# EAGLE design feedthrough_board (EAGLE 9.3.0)
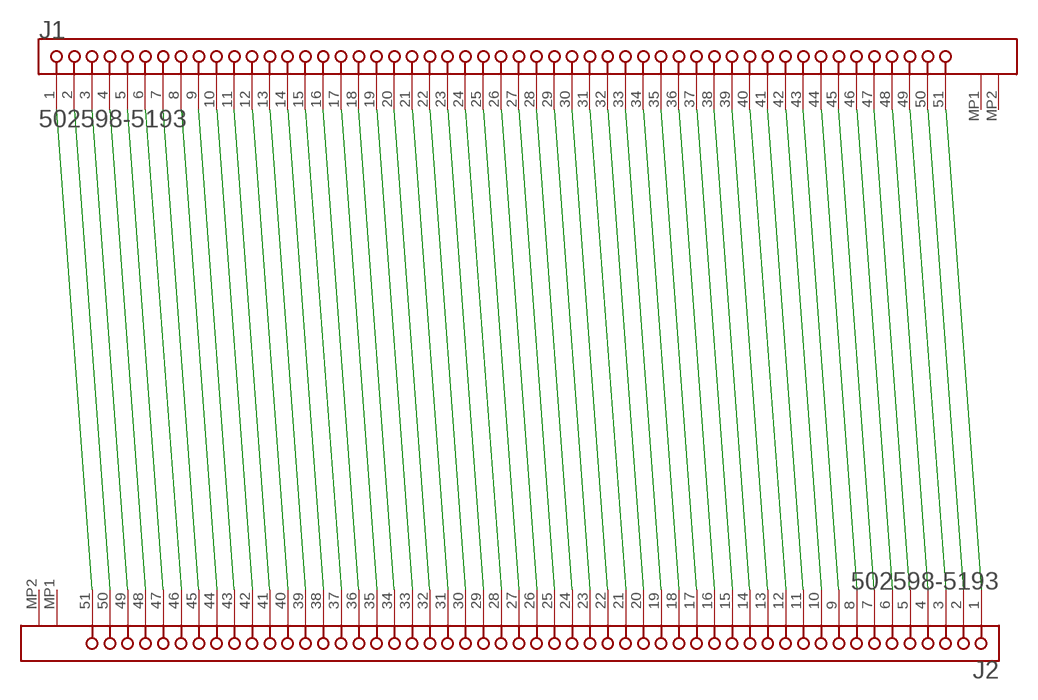
[diagram p0: schematic, sheet 1]

## Parts
J1  MOLEX_502598-5193MOLEX_502598-5193_0_0  [MOLEX_502598-5193_0]
J2  MOLEX_502598-5193MOLEX_502598-5193_0_0  [MOLEX_502598-5193_0]

## Nets
A1: J1.1 J2.51
A2: J1.2 J2.50
A3: J1.3 J2.49
A4: J1.4 J2.48
A5: J1.5 J2.47
A6: J1.6 J2.46
A7: J1.7 J2.45
A8: J1.8 J2.44
A9: J1.9 J2.43
A10: J1.10 J2.42
A11: J1.11 J2.41
A12: J1.12 J2.40
A13: J1.13 J2.39
A14: J1.14 J2.38
A15: J1.15 J2.37
A16: J1.16 J2.36
A17: J1.17 J2.35
A18: J1.18 J2.34
A19: J1.19 J2.33
A20: J1.20 J2.32
A21: J1.21 J2.31
A22: J1.22 J2.30
A23: J1.23 J2.29
A24: J1.24 J2.28
A25: J1.25 J2.27
A26: J1.26 J2.26
A27: J1.27 J2.25
A28: J1.28 J2.24
A29: J1.29 J2.23
A30: J1.30 J2.22
A31: J1.31 J2.21
A32: J1.32 J2.20
A33: J1.33 J2.19
A34: J1.34 J2.18
A35: J1.35 J2.17
A36: J1.36 J2.16
A37: J1.37 J2.15
A38: J1.38 J2.14
A39: J1.39 J2.13
A40: J1.40 J2.12
A41: J1.41 J2.11
A42: J1.42 J2.10
A43: J1.43 J2.9
A44: J1.44 J2.8
A45: J1.45 J2.7
A46: J1.46 J2.6
A47: J1.47 J2.5
A48: J1.48 J2.4
A49: J1.49 J2.3
A50: J1.50 J2.2
A51: J1.51 J2.1
Unconnected: J1.MP1 J1.MP2 J2.MP1 J2.MP2

## Library data of the parts
J1 J2 = Molex - 502598-5193:MOLEX_502598-5193: MOLX-502598-5193; CIIVA_IDS: 8412513; CIRCUITS_LOADED: 51; COMPONENT_LINK_1_DESCRIPTION: Manufacturer URL; COMPONENT_LINK_1_URL: http://www.molex.com/molex/index.jsp; COMPONENT_LINK_3_DESCRIPTION: Package Specification; COMPONENT_LINK_3_URL: http://www.molex.com/pdm_docs/sd/5025985193_sd.pdf; CONTACT_POSITION: Dual; CURRENT_MAX_PER_CONTACT: 0.2A; DATASHEET: http://www.molex.com/webdocs/datasheets/pdf/en-us/5025985193_FFC_FPC_CONNECTORS.pdf; DURABILITY_MATING_CYCLES_MAX: 10; ENTRY_ANGLE: 90degrees Angle; FOOTPRINT_VARIANT_NAME_0: Manufacturer Recommended; IMPORTED: yes; IMPORTED_FROM: vault; IMPORT_TS: 1521860080; MATED_HEIGHT: 1.15mm; MATERIAL___METAL: Copper Alloy, Phosphor Bronze; MATERIAL___PLATING_MATING: Gold; MATERIAL___PLATING_TERMINATION: Gold, Tin; MF: Molex; MOUNTING_TECHNOLOGY: Surface Mount; MPN: 502598-5193; NUMBER_OF_ROWS: 1; ORIENTATION: Right Angle; PACKAGE: 502598-5193; PACKAGE_DESCRIPTION: 51-Lead FPC Connector, Pitch 0.3 mm; PACKAGE_VERSION: Rev. B, 08/2013; PACKING: Tape and Reel; PCB_LOCATOR: No; PCB_RETENTION: Yes; PITCH___MATING_INTERFACE: 0.30mm; POLARIZED_TO_PCB: Yes; PREFIX: J; RELEASE_DATE: 1411372322; ROHS: Yes; STACKABLE: No; VAULT_GUID: 79943B7E-3FDB-4B6C-B1B1-74E826A886CC; VAULT_REVISION: 2B392736-9C86-4257-9195-559BF0CEA94B; VOLTAGE_MAX: 50V AC (RMS)/DC

## Net classes
0 signal: width 0.127 mm, clearance 0.127 mm

## Board
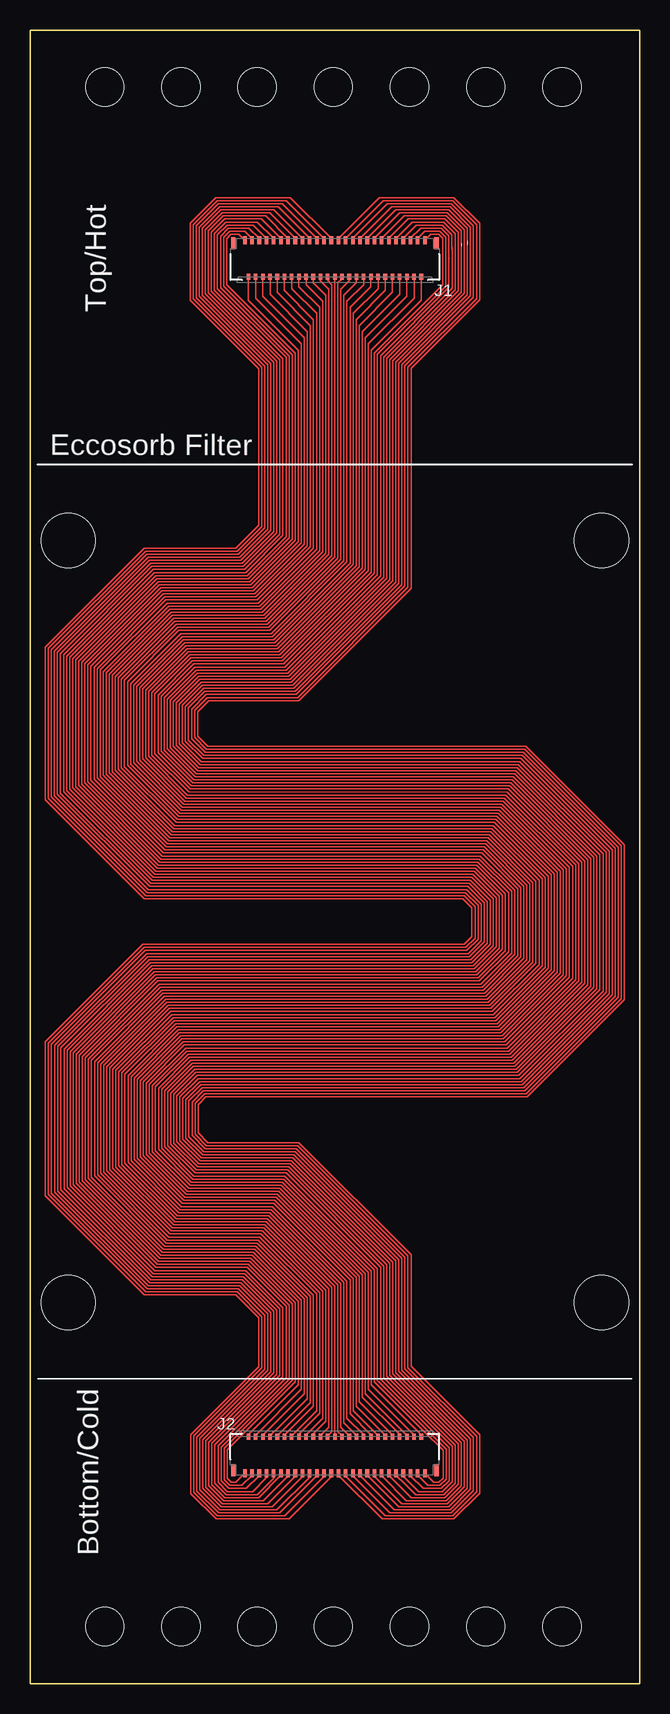
[diagram p1: board, top side]

Size 50.8 x 137.79 mm. Coordinates in mm from the lower left corner, seen from the top.
Outline: 50.8,51.44 50.8,52.07
Outline: 0,51.44 0,52.07
Outline: 0,0 50.8,0 50.8,137.79 0,137.79 0,0
Copper layers (1*16): Top 0.035mm / dielectric 0.25mm / Bottom 0.035mm
Design rules "SparkFun-2-layer-FAB-LIMIT *": minimum track width 5mil, minimum drill 0.2mm, track to track 5mil, track to pad 5mil, pad to pad 5mil, via to via 5mil, smd to smd 5mil, copper to edge 5mil, drill to drill 5mil, minimum pad ring 3mil, minimum via ring 3mil, stop-mask expansion 5mil, vias tented up to drill 25mil, thermal gap 10mil
Holes 3.17 mm at 6.22,4.76 44.32,4.76 12.57,4.76 37.97,4.76 18.92,4.76 25.27,4.76 31.62,4.76 6.22,133.03 44.32,133.03 12.57,133.03 37.97,133.03 18.92,133.03 25.27,133.03 31.62,133.03
Holes 4.5 mm at 3.17,31.75 47.62,31.75 47.62,95.25 3.17,95.25
tRestrict: area 0,92.1 to 6.3,98.4; area 44.5,92.1 to 50.8,98.4; area 44.5,28.6 to 50.8,34.9; area 0,28.6 to 6.3,34.9; area 15.9,115.1 to 34.9,121.2; area 17.3,111.4 to 33.5,116.2; area 16,16.1 to 34.8,22.2
bRestrict: area 0,92.1 to 6.3,98.4; area 44.5,92.1 to 50.8,98.4; area 44.5,28.6 to 50.8,34.9; area 0,28.6 to 6.3,34.9; area 3.2,130.2 to 47.6,136.5; area 3.2,1.6 to 47.6,7.9
vRestrict: area 15.9,16.5 to 34.9,21.6

### Footprints (pad centres in the part's own frame; a part is rotated, then mirrored left to right if it is on the bottom)
MOLEX_502598-5193_0 = smd 0.3 x 0.67: 1 -7.5,-1.532; 3 -6.9,-1.532; 5 -6.3,-1.532; 7 -5.7,-1.532; 9 -5.1,-1.532; 11 -4.5,-1.532; 13 -3.9,-1.532; 15 -3.3,-1.532; 17 -2.7,-1.532; 19 -2.1,-1.532; 21 -1.5,-1.532; 23 -0.9,-1.532; 25 -0.3,-1.532; 27 0.3,-1.532; 29 0.9,-1.532; 31 1.5,-1.532; 33 2.1,-1.532; 35 2.7,-1.532; 37 3.3,-1.532; 39 3.9,-1.532; 41 4.5,-1.532; 43 5.1,-1.532; 45 5.7,-1.532; 47 6.3,-1.532; 49 6.9,-1.532; 51 7.5,-1.532 | smd 0.3 x 0.5: 2 -7.2,1.532; 4 -6.6,1.532; 6 -6,1.532; 8 -5.4,1.532; 10 -4.8,1.532; 12 -4.2,1.532; 14 -3.6,1.532; 16 -3,1.532; 18 -2.4,1.532; 20 -1.8,1.532; 22 -1.2,1.532; 24 -0.6,1.532; 26 0,1.532; 28 0.6,1.532; 30 1.2,1.532; 32 1.8,1.532; 34 2.4,1.532; 36 3,1.532; 38 3.6,1.532; 40 4.2,1.532; 42 4.8,1.532; 44 5.4,1.532; 46 6,1.532; 48 6.6,1.532; 50 7.2,1.532 | smd 0.35 x 1: MP1 -8.475,-1.267; MP2 8.475,-1.267

### Placement (x,y rotation side)
J1  25.4,118.75 180 top
J2  25.4,19.05 0 top

### Tracks (layer width: path | path; a pad name or v marks a point on that pad's centre or on a via)
A1
  Top 0.127: J2.51 33.65,16.76 34.05,16.76 34.42,17.13 34.42,19.43 32.83,21.02 28.7,25.15 28.7,34.48 21.14,42.04 13.54,42.04 10.96,44.62 10.96,49.51 13.4,51.94 40.19,51.94 46.48,58.23 46.48,68.64 40.07,75.06 13.54,75.06 10.92,77.68 10.92,82.26 13.62,84.96 21.14,84.96 28.7,92.52 28.7,110.86 34.4,116.56 34.4,119.25 34.4,119.41 34.4,120.43 34.05,120.78 33.4,120.78 J1.1
A2
  Top 0.127: J2.50 32.6,20.74 28.45,24.89 28.45,34.37 21.04,41.78 13.44,41.78 10.71,44.51 10.71,49.62 13.29,52.2 40.09,52.2 46.23,58.34 46.23,68.54 39.96,74.8 13.44,74.8 10.67,77.58 10.67,82.36 13.52,85.22 21.04,85.22 28.45,92.63 28.45,111.12 32.6,115.28 J1.2
A3
  Top 0.127: J2.49 32.3,17.36 33.15,16.51 34.16,16.51 34.67,17.02 34.67,19.54 30.61,23.6 30.61,23.62 29.08,25.15 29.06,25.15 28.96,25.25 28.96,34.58 21.25,42.29 13.65,42.29 11.22,44.72 11.22,49.41 13.5,51.69 40.3,51.69 46.74,58.13 46.74,68.75 40.17,75.31 13.65,75.31 11.18,77.78 11.18,82.16 13.73,84.71 21.25,84.71 28.96,92.42 28.96,110.75 34.66,116.46 34.66,119.38 34.66,119.51 34.66,120.53 34.16,121.03 32.9,121.03 32.3,120.44 J1.3
A4
  Top 0.127: J2.48 32,20.7 28.19,24.51 28.19,34.27 20.93,41.53 13.33,41.53 10.46,44.41 10.46,49.72 13.19,52.45 39.98,52.45 45.97,58.44 45.97,68.43 39.86,74.55 13.33,74.55 10.41,77.47 10.41,82.47 13.41,85.47 20.93,85.47 28.19,92.73 28.19,111.63 32,115.44 J1.4
A5
  Top 0.127: J2.47 31.7,17.32 32.77,16.26 34.27,16.26 34.92,16.92 34.92,19.66 29.21,25.38 29.21,34.69 21.35,42.55 13.75,42.55 11.47,44.83 11.47,49.3 13.61,51.44 40.4,51.44 46.99,58.02 46.99,68.85 40.28,75.56 13.75,75.56 11.43,77.89 11.43,82.04 13.84,84.45 21.35,84.45 29.21,92.31 29.21,110.65 34.91,116.35 34.91,118.73 34.92,118.75 34.91,118.76 34.91,119.38 34.91,119.61 34.91,120.64 34.27,121.28 32.55,121.28 31.71,120.44 J1.5
A6  (1 unrouted)
  Top 0.127: J2.46 31.4,20.67 27.94,24.13 27.94,34.16 20.83,41.27 13.23,41.27 10.2,44.3 10.2,49.83 13.08,52.7 39.88,52.7 45.72,58.55 45.72,68.33 39.75,74.3 13.23,74.3 10.16,77.36 10.16,82.58 13.31,85.72 20.83,85.72 27.94,92.84 27.94,112.14 31.4,115.6 J1.6
A7
  Top 0.127: 35.18,119.71 35.18,119.51 | 35.18,119.51 35.18,116.26 29.46,110.55 29.46,92.21 21.46,84.2 13.95,84.2 11.68,81.94 11.68,78 13.86,75.82 40.38,75.82 47.24,68.96 47.24,57.92 40.51,51.18 13.71,51.18 11.73,49.2 11.73,44.93 13.86,42.8 21.46,42.8 29.46,34.79 29.46,25.48 35.18,19.77 35.18,16.81 34.37,16 32.38,16 31.1,17.29 J2.45 | 35.18,119.51 35.16,119.52 35.16,120.74 34.37,121.54 32.21,121.54 31.1,120.44 J1.7
A8
  Top 0.127: J2.44 30.8,20.76 27.69,23.88 27.69,34.06 20.72,41.02 13.12,41.02 9.95,44.2 9.95,49.93 12.97,52.96 39.77,52.96 45.47,58.65 45.47,68.22 39.64,74.04 13.12,74.04 9.91,77.26 9.91,82.68 13.2,85.98 20.72,85.98 27.69,92.94 27.69,112.65 30.8,115.76 J1.8
A9
  Top 0.127: J2.43 30.5,17.36 30.87,16.99 30.89,16.99 32.13,15.75 34.47,15.75 35.43,16.71 35.43,19.87 29.72,25.59 29.72,34.9 21.56,43.05 13.97,43.05 11.98,45.04 11.98,49.09 13.82,50.93 40.61,50.93 47.5,57.81 47.5,69.06 40.49,76.07 13.97,76.07 11.94,78.1 11.94,81.83 14.05,83.95 21.56,83.95 29.72,92.1 29.72,110.44 35.43,116.16 35.43,119.81 35.43,120.83 34.47,121.79 31.86,121.79 30.51,120.44 J1.9
A10
  Top 0.127: J2.42 30.2,20.73 27.43,23.5 27.43,33.95 20.62,40.77 13.02,40.77 9.69,44.09 9.69,50.04 12.87,53.21 39.67,53.21 45.21,58.76 45.21,68.11 39.54,73.79 13.02,73.79 9.65,77.15 9.65,82.79 13.1,86.23 20.62,86.23 27.43,93.05 27.43,113.16 30.2,115.92 J1.10
A11
  Top 0.127: J2.41 29.9,17.34 31.75,15.49 34.58,15.49 35.26,16.17 | 35.26,16.17 | 35.26,16.17 35.69,16.6 35.69,19.98 29.97,25.69 29.97,35 21.67,43.31 14.07,43.31 12.23,45.14 12.23,48.98 13.92,50.67 40.72,50.67 47.75,57.71 47.75,69.17 40.59,76.33 14.07,76.33 12.19,78.21 12.19,81.73 14.16,83.69 21.67,83.69 29.97,92 29.97,110.33 35.69,116.05 35.69,119.76 35.69,119.92 35.69,120.94 34.58,122.05 31.52,122.05 29.9,120.44 J1.11
A12
  Top 0.127: J2.40 29.6,20.69 27.18,23.11 27.18,33.85 20.51,40.51 12.91,40.51 9.44,43.99 9.44,50.14 12.76,53.47 39.56,53.47 44.96,58.86 44.96,68.01 39.44,73.53 12.91,73.53 9.4,77.05 9.4,82.89 12.99,86.49 20.51,86.49 27.18,93.15 27.18,113.67 29.6,116.09 J1.12
A13  (2 unrouted)
  Top 0.127: 35.94,120.02 35.94,115.94 30.23,110.23 30.23,91.89 21.77,83.44 14.26,83.44 12.45,81.62 12.45,78.31 14.18,76.58 40.7,76.58 48.01,69.27 48.01,57.6 40.82,50.42 14.03,50.42 12.49,48.88 12.49,45.25 14.18,43.56 21.77,43.56 30.23,35.11 30.23,25.8 35.94,20.08 35.94,16.5 34.69,15.24 31.37,15.24 29.3,17.31 J2.39 | 35.94,119.76 35.94,121.05 34.69,122.3 31.17,122.3 29.3,120.44 J1.13
A14
  Top 0.127: J2.38 29,20.66 26.92,22.73 26.92,33.74 20.41,40.26 12.81,40.26 9.19,43.88 9.19,50.25 12.66,53.72 39.46,53.72 44.7,58.97 44.7,67.91 39.33,73.28 12.81,73.28 9.14,76.94 9.14,83 12.89,86.74 20.41,86.74 26.92,93.26 26.92,114.17 29,116.25 J1.14
A15
  Top 0.127: J2.37 28.7,17.27 30.99,14.99 34.79,14.99 36.2,16.39 36.2,20.19 30.48,25.9 30.48,35.22 21.88,43.81 14.28,43.81 12.74,45.35 12.74,48.77 14.13,50.16 40.93,50.16 48.26,57.49 48.26,69.38 40.8,76.83 14.28,76.83 12.7,78.42 12.7,81.52 14.37,83.19 21.88,83.19 30.48,91.78 30.48,110.12 36.2,115.84 36.2,119.89 36.2,120.13 36.2,121.15 34.79,122.56 30.82,122.56 28.7,120.44 J1.15
A16
  Top 0.127: J2.36 28.4,20.75 26.67,22.48 26.67,33.64 20.3,40.01 12.7,40.01 8.93,43.78 8.93,50.35 12.55,53.98 39.35,53.98 44.45,59.07 44.45,67.8 39.22,73.03 12.7,73.03 8.89,76.84 8.89,83.1 12.78,87 20.3,87 26.67,93.36 26.67,114.68 28.4,116.41 J1.16
A17  (2 unrouted)
  Top 0.127: 36.45,120.23 36.45,115.73 30.73,110.02 30.73,91.68 21.98,82.93 14.47,82.93 12.95,81.41 12.95,78.52 14.39,77.09 40.91,77.09 48.51,69.48 48.51,57.39 41.03,49.91 14.24,49.91 13,48.67 13,45.46 14.39,44.07 21.98,44.07 30.73,35.32 30.73,26.01 36.45,20.29 36.45,16.29 34.9,14.73 30.73,14.73 28.47,16.99 28.1,17.36 J2.35 | 36.45,119.89 36.45,121.26 34.9,122.81 30.48,122.81 28.1,120.44 J1.17
A18
  Top 0.127: J2.34 27.8,20.71 26.42,22.1 26.42,33.53 20.2,39.75 12.6,39.75 8.68,43.67 8.68,50.46 12.45,54.23 39.25,54.23 44.2,59.18 44.2,67.69 39.12,72.77 12.6,72.77 8.64,76.73 8.64,83.21 12.68,87.25 20.2,87.25 26.42,93.47 26.42,115.19 27.8,116.57 J1.18
A19
  Top 0.127: J2.33 27.5,17.33 30.35,14.48 35,14.48 36.7,16.18 36.7,20.4 30.99,26.11 30.99,35.42 22.09,44.32 14.49,44.32 13.25,45.56 13.25,48.56 14.34,49.66 41.14,49.66 48.77,57.28 48.77,69.59 41.01,77.34 14.49,77.34 13.21,78.63 13.21,81.31 14.58,82.68 22.09,82.68 30.99,91.58 30.99,109.91 36.7,115.63 36.7,119.76 36.7,120.34 36.7,121.36 35,123.06 30.13,123.06 27.5,120.43 J1.19
A20
  Top 0.127: J2.32 27.2,20.68 26.16,21.72 26.16,33.43 20.09,39.5 12.49,39.5 8.42,43.57 8.42,50.56 12.34,54.48 39.14,54.48 43.94,59.28 43.94,67.59 39.01,72.52 12.49,72.52 8.38,76.63 8.38,83.31 12.57,87.5 20.09,87.5 26.16,93.57 26.16,115.7 27.2,116.73 J1.20
A21
  Top 0.127: J2.31 26.9,17.3 29.97,14.22 35.11,14.22 36.96,16.07 36.96,20.5 31.24,26.22 31.24,35.53 22.2,44.58 14.6,44.58 13.5,45.67 13.5,48.46 14.45,49.4 41.24,49.4 49.02,57.18 49.02,69.69 41.12,77.6 14.6,77.6 13.46,78.73 13.46,81.2 14.68,82.42 22.2,82.42 31.24,91.47 31.24,109.81 36.96,115.52 36.96,120.27 36.96,120.44 36.96,121.47 35.11,123.32 29.79,123.32 26.91,120.44 J1.21
A22
  Top 0.127: J2.30 26.6,20.65 25.91,21.34 25.91,33.32 19.99,39.24 12.39,39.24 8.17,43.46 8.17,50.67 12.24,54.74 39.04,54.74 43.69,59.39 43.69,67.48 38.91,72.26 12.39,72.26 8.13,76.52 8.13,83.49 12.4,87.76 19.99,87.76 25.91,93.68 25.91,116.2 26.6,116.9 J1.22
A23
  Top 0.127: J2.29 26.3,17.26 29.59,13.97 35.21,13.97 37.21,15.97 37.21,20.61 31.5,26.32 31.5,35.63 22.3,44.83 14.7,44.83 13.76,45.77 13.76,48.35 14.55,49.15 41.35,49.15 49.28,57.08 49.28,69.8 41.22,77.85 14.7,77.85 13.72,78.84 13.72,81.09 14.79,82.17 22.3,82.17 31.5,91.36 31.5,109.7 37.21,115.42 37.21,119.51 37.21,120.55 37.21,121.57 35.21,123.57 29.44,123.57 26.3,120.44 J1.23
A24
  Top 0.127: J2.28 26,20.65 25.65,21 25.65,33.22 19.88,38.99 12.28,38.99 7.92,43.36 7.92,50.77 12.13,54.99 38.93,54.99 43.43,59.49 43.43,67.38 38.8,72.01 12.28,72.01 7.87,76.42 7.87,83.59 12.29,88.01 19.88,88.01 25.65,93.78 25.65,116.71 26,117.06 J1.24
A25  (1 unrouted)
  Top 0.127: J2.27 25.7,17.35 29.34,13.72 35.32,13.72 37.46,15.86 37.46,20.71 31.75,26.43 31.75,35.74 22.41,45.09 14.81,45.09 14.01,45.88 14.01,48.25 14.66,48.9 41.46,48.9 49.53,56.97 49.53,69.9 41.33,78.11 14.81,78.11 13.97,78.94 13.97,80.99 14.89,81.92 22.41,81.92 31.75,91.26 31.75,109.6 37.46,115.31 37.46,120.27 37.46,120.65 37.46,121.68 35.32,123.83 29.09,123.83 25.69,120.42 25.7,120.4 J1.25
A26
  Top 0.127: J2.26 25.4,33.11 19.77,38.73 12.18,38.73 7.66,43.25 7.66,50.88 12.03,55.24 38.83,55.24 43.18,59.6 43.18,67.27 38.7,71.75 12.18,71.75 7.62,76.31 7.62,83.7 12.19,88.27 19.77,88.27 25.4,93.89 J1.26
A27
  Top 0.127: J2.25 25.1,17.23 21.59,13.72 15.5,13.72 13.38,15.83 13.38,20.75 19.05,26.41 19.05,30.48 17.14,32.38 9.52,32.38 1.27,40.64 1.27,53.47 9.4,61.59 36.2,61.59 36.83,62.23 36.83,64.64 36.07,65.41 9.52,65.41 1.27,73.66 1.27,86.36 9.52,94.61 17.14,94.61 19.05,96.52 19.05,109.56 13.33,115.28 13.33,121.68 15.48,123.83 21.71,123.83 25.09,120.44 J1.27
A28
  Top 0.127: J2.24 24.8,20.65 25.15,21 25.15,33.01 19.67,38.48 12.07,38.48 7.41,43.15 7.41,50.98 11.92,55.5 38.72,55.5 42.93,59.7 42.93,67.17 38.59,71.5 12.07,71.5 7.37,76.21 7.37,83.8 12.08,88.52 19.67,88.52 25.15,94 25.15,116.59 25.08,116.65 24.8,116.93 J1.28
A29
  Top 0.127: J2.23 24.5,17.26 21.21,13.97 15.61,13.97 13.64,15.94 13.64,20.64 19.3,26.31 19.3,30.59 17.25,32.64 9.65,32.64 1.52,40.77 1.52,53.36 9.5,61.34 36.3,61.34 37.08,62.12 37.08,64.75 36.17,65.66 9.65,65.66 1.52,73.79 1.52,86.25 9.63,94.36 17.25,94.36 19.3,96.42 19.3,109.67 13.59,115.39 13.59,121.57 15.59,123.57 21.36,123.57 24.49,120.44 J1.29
A30
  Top 0.127: J2.22 24.2,20.65 24.89,21.34 24.89,32.9 19.56,38.23 11.97,38.23 7.15,43.04 7.15,51.09 11.82,55.75 38.61,55.75 42.67,59.81 42.67,67.06 38.49,71.25 11.97,71.25 7.11,76.1 7.11,83.91 11.98,88.77 19.56,88.77 24.89,94.1 24.89,116.2 24.2,116.9 J1.30
A31
  Top 0.127: J2.21 23.9,17.3 20.83,14.22 15.71,14.22 13.89,16.04 13.89,20.54 19.56,26.2 19.56,30.69 17.35,32.89 9.76,32.89 1.78,40.87 1.78,53.26 9.61,61.09 36.41,61.09 37.34,62.02 37.34,64.85 36.28,65.91 9.76,65.91 1.78,73.89 1.78,86.15 9.73,94.11 17.35,94.11 19.56,96.31 19.56,109.78 13.84,115.49 13.84,121.47 15.69,123.32 21.01,123.32 23.89,120.44 J1.31
A32
  Top 0.127: J2.20 23.6,20.81 24.64,21.84 24.64,32.8 19.46,37.97 11.86,37.97 6.9,42.94 6.9,51.19 11.71,56.01 38.51,56.01 42.42,59.91 42.42,66.96 38.38,70.99 11.86,70.99 6.86,76 6.86,84.01 11.87,89.03 19.46,89.03 24.64,94.2 24.64,115.7 23.6,116.73 J1.32
A33
  Top 0.127: J2.19 23.3,17.2 20.57,14.48 15.82,14.48 14.15,16.15 14.15,20.43 19.81,26.1 19.81,30.8 17.46,33.15 9.86,33.15 2.07,40.94 2.07,53.19 9.71,60.83 36.51,60.83 37.59,61.91 37.59,64.96 36.38,66.17 9.86,66.17 2.03,74 2.03,86.04 9.84,93.85 17.46,93.85 19.81,96.2 19.81,109.88 14.1,115.6 14.1,121.36 15.8,123.06 20.67,123.06 23.29,120.44 J1.33
A34
  Top 0.127: J2.18 23,20.71 24.38,22.1 24.38,32.69 19.35,37.72 11.76,37.72 6.65,42.83 6.65,51.3 11.61,56.26 38.4,56.26 42.16,60.02 42.16,66.85 38.28,70.74 11.76,70.74 6.6,75.89 6.6,84.12 11.77,89.28 19.35,89.28 24.38,94.31 24.38,115.19 23,116.57 J1.34
A35
  Top 0.127: J2.17 22.7,17.24 20.19,14.73 15.92,14.73 14.4,16.25 14.4,20.33 20.07,25.99 20.07,30.9 17.57,33.4 9.97,33.4 2.33,41.04 2.33,53.09 9.82,60.58 36.62,60.58 37.85,61.81 37.85,65.06 36.49,66.42 9.97,66.42 2.29,74.1 2.29,85.94 9.95,93.6 17.57,93.6 20.07,96.1 20.07,109.99 14.35,115.7 14.35,118.75 14.35,120.23 14.35,121.26 15.9,122.81 20.32,122.81 22.7,120.44 J1.35
A36
  Top 0.127: J2.16 22.4,20.78 24.13,22.51 24.13,32.58 19.25,37.47 11.65,37.47 6.39,42.72 6.39,51.4 11.5,56.52 38.3,56.52 41.91,60.13 41.91,66.75 38.17,70.48 11.65,70.48 6.35,75.79 6.35,84.22 11.66,89.53 19.25,89.53 24.13,94.42 24.13,114.68 22.4,116.41 J1.36
A37
  Top 0.127: J2.15 22.1,17.27 19.81,14.99 16.03,14.99 14.65,16.36 14.65,20.22 20.32,25.89 20.32,31.01 17.67,33.66 10.07,33.66 2.58,41.15 2.58,52.98 9.92,60.33 36.72,60.33 38.1,61.7 38.1,65.17 36.59,66.67 10.07,66.67 2.54,74.21 2.54,85.83 10.05,93.34 17.67,93.34 20.32,95.99 20.32,110.09 14.6,115.81 14.6,121.15 16.01,122.56 19.98,122.56 22.09,120.44 J1.37
A38
  Top 0.127: J2.14 21.8,20.66 23.88,22.73 23.88,32.48 19.14,37.21 11.55,37.21 6.14,42.62 6.14,51.51 11.4,56.77 38.19,56.77 41.66,60.23 41.66,66.64 38.07,70.23 11.55,70.23 6.1,75.68 6.1,84.33 11.56,89.79 19.14,89.79 23.88,94.52 23.88,114.17 21.8,116.25 J1.38
A39
  Top 0.127: J2.13 21.5,17.31 19.43,15.24 16.13,15.24 14.91,16.46 14.91,20.11 20.57,25.78 20.57,31.11 17.78,33.91 10.18,33.91 2.84,41.25 2.84,52.88 10.03,60.07 36.83,60.07 38.35,61.6 38.35,65.27 36.7,66.93 10.18,66.93 2.79,74.31 2.79,85.73 10.16,93.09 17.78,93.09 20.57,95.89 20.57,110.2 14.86,115.91 14.86,118.75 14.86,120.02 14.86,121.05 16.11,122.3 19.63,122.3 21.49,120.44 J1.39
A40
  Top 0.127: J2.12 21.2,20.69 23.62,23.11 23.62,32.37 19.04,36.96 11.44,36.96 5.88,42.51 5.88,51.62 11.29,57.02 38.09,57.02 41.4,60.34 41.4,66.54 37.96,69.98 11.44,69.98 5.84,75.58 5.84,84.47 11.42,90.04 19.04,90.04 23.62,94.63 23.62,113.67 21.2,116.09 J1.40
A41
  Top 0.127: J2.11 20.9,17.34 19.05,15.49 16.24,15.49 15.16,16.57 15.16,20.01 20.83,25.68 20.83,31.22 17.88,34.16 10.28,34.16 3.09,41.36 3.09,52.77 10.13,59.82 36.93,59.82 38.61,61.49 38.61,65.38 36.8,67.18 10.28,67.18 3.05,74.42 3.05,85.62 10.26,92.84 17.88,92.84 20.83,95.78 20.83,110.3 15.11,116.02 15.11,118.75 15.11,119.92 15.11,120.94 16.22,122.05 19.28,122.05 20.89,120.44 J1.41
A42
  Top 0.127: J2.10 20.6,20.65 23.37,23.42 23.37,32.27 18.93,36.7 11.33,36.7 5.63,42.41 5.63,51.72 11.19,57.28 37.98,57.28 41.15,60.44 41.15,66.43 37.86,69.72 11.33,69.72 5.59,75.47 5.59,84.57 11.31,90.3 18.93,90.3 23.37,94.73 23.37,113.16 20.6,115.92 J1.42
A43  (1 unrouted)
  Top 0.127: J2.9 20.3,17.12 18.92,15.75 16.34,15.75 15.42,16.68 15.42,19.91 21.08,25.57 21.08,31.32 17.99,34.42 10.39,34.42 3.34,41.46 3.34,52.67 10.24,59.56 37.04,59.56 38.86,61.39 38.86,65.48 36.91,67.44 10.39,67.44 3.3,74.52 3.3,85.52 10.37,92.58 17.99,92.58 21.08,95.68 21.08,110.41 15.37,116.12 15.37,118.75 15.37,119.81 15.37,120.83 16.32,121.79 18.94,121.79 20.29,120.44 J1.43
A44
  Top 0.127: J2.8 20,20.65 20.37,21.02 20.39,21.02 23.11,23.75 23.11,32.16 18.83,36.45 11.23,36.45 5.38,42.3 5.38,51.83 11.08,57.53 37.88,57.53 40.89,60.55 40.89,66.33 37.75,69.47 11.23,69.47 5.33,75.36 5.33,84.68 11.21,90.55 18.83,90.55 23.11,94.84 23.11,112.65 20,115.76 J1.44
A45
  Top 0.127: J2.7 19.7,17.16 18.54,16 16.45,16 15.67,16.78 15.67,19.8 21.34,25.46 21.34,31.43 18.09,34.67 10.49,34.67 3.6,41.57 3.6,52.56 10.34,59.31 37.14,59.31 39.12,61.28 39.12,65.59 37.02,67.69 10.49,67.69 3.56,74.63 3.56,85.41 10.47,92.33 18.09,92.33 21.34,95.57 21.34,110.51 15.62,116.23 15.62,120.73 16.43,121.54 18.59,121.54 19.7,120.44 J1.45
A46  (1 unrouted)
  Top 0.127: J2.6 19.4,20.67 22.86,24.13 22.86,32.06 18.72,36.2 11.12,36.2 5.12,42.2 5.12,51.93 10.98,57.78 37.77,57.78 40.64,60.65 40.64,66.22 37.65,69.22 11.12,69.22 5.08,75.26 5.08,84.78 11.1,90.81 18.72,90.81 22.86,94.94 22.86,112.14 19.4,115.6 J1.46
A47
  Top 0.127: J2.5 19.1,17.32 18.03,16.26 16.55,16.26 15.92,16.89 15.92,19.69 21.59,25.36 21.59,31.53 18.2,34.92 10.6,34.92 3.85,41.67 3.85,52.46 10.45,59.05 37.25,59.05 39.37,61.18 39.37,65.69 37.12,67.94 10.6,67.94 3.81,74.73 3.81,85.31 10.58,92.08 18.2,92.08 21.59,95.47 21.59,110.62 15.87,116.33 15.87,118.75 15.87,119.6 15.87,120.62 16.53,121.28 18.25,121.28 19.09,120.44 J1.47
A48
  Top 0.127: J2.4 18.8,20.7 22.61,24.51 22.61,31.95 18.62,35.94 11.02,35.94 4.87,42.09 4.87,52.04 10.87,58.04 37.67,58.04 40.39,60.76 40.39,66.12 37.54,68.96 11.02,68.96 4.83,75.16 4.83,84.89 11,91.06 18.62,91.06 22.61,95.05 22.61,111.63 18.8,115.44 J1.48
A49
  Top 0.127: J2.3 18.5,17.36 17.65,16.51 16.66,16.51 16.18,16.99 16.18,19.59 21.84,25.25 21.84,31.64 18.3,35.18 10.7,35.18 4.11,41.78 4.11,52.35 10.55,58.8 37.35,58.8 39.62,61.07 39.62,65.8 37.22,68.2 10.7,68.2 4.06,74.84 4.06,85.2 10.68,91.82 18.3,91.82 21.84,95.36 21.84,110.72 16.13,116.44 16.13,120.52 16.64,121.03 17.9,121.03 18.49,120.44 J1.49
A50
  Top 0.127: J2.2 18.2,20.74 22.35,24.89 22.35,31.85 18.51,35.69 10.91,35.69 4.61,41.99 4.61,52.14 10.77,58.29 37.56,58.29 40.13,60.86 40.13,66.01 37.44,68.71 10.91,68.71 4.57,75.05 4.57,84.99 10.89,91.31 18.51,91.31 22.35,95.15 22.35,111.12 18.2,115.28 J1.50
A51
  Top 0.127: J2.1 17.15,16.76 16.76,16.76 16.43,17.1 16.43,19.48 22.1,25.15 22.1,31.74 18.41,35.43 10.81,35.43 4.36,41.88 4.36,52.25 10.66,58.55 37.46,58.55 39.88,60.97 39.88,65.91 37.33,68.45 10.81,68.45 4.32,74.94 4.32,85.1 10.79,91.57 18.41,91.57 22.1,95.26 22.1,110.86 16.38,116.58 16.38,120.41 16.75,120.78 17.4,120.78 J1.51

### Text on the board
tPlace: Top/Hot | Eccosorb Filter | Bottom/Cold